# Altium schematic sheet ESP8266 Core.SchDoc
size 165 x 190 mm
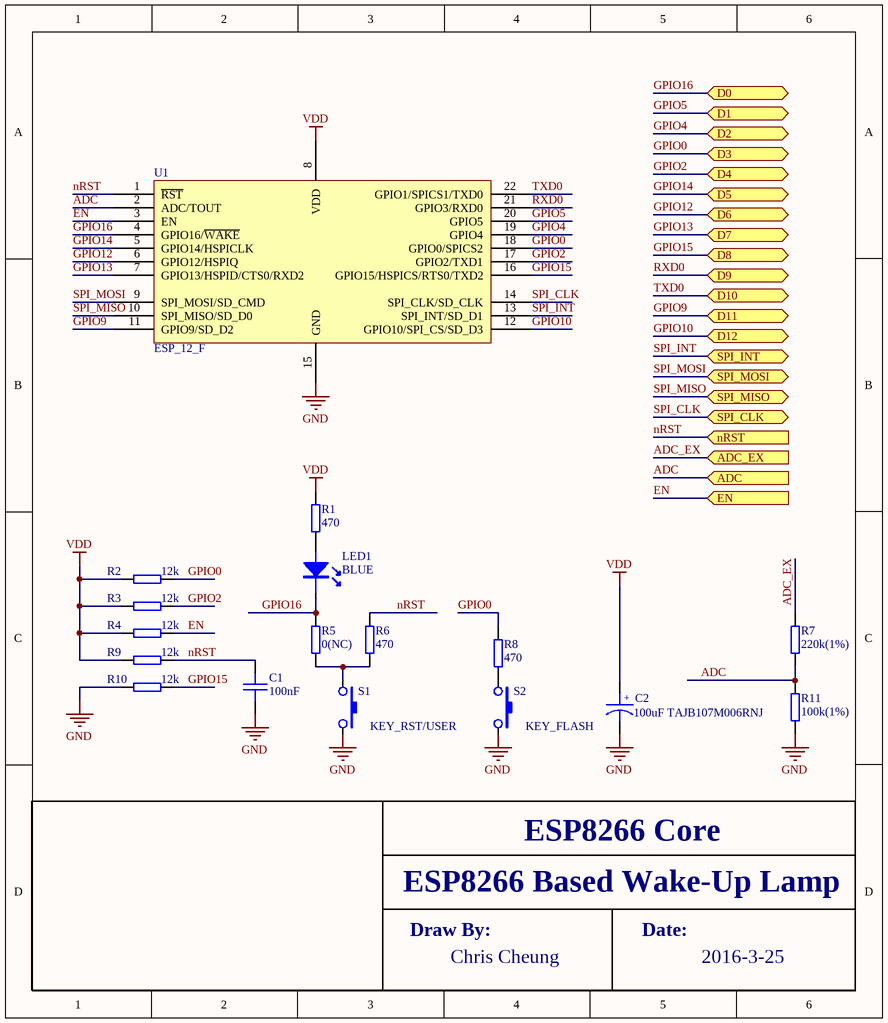
[diagram p0: ESP8266 Core.SchDoc]

## Parts
C1  100nF  [SMT_C_0402]
C2  100uF TAJB107M006RNJ  [SMT_C_Tantalum_B]
LED1  BLUE  [SMT_LED_0603]
R1  470  [SMT_R_0402]
R2  12k  [SMT_R_0402]
R3  12k  [SMT_R_0402]
R4  12k  [SMT_R_0402]
R5  0(NC)  [SMT_R_0402]
R6  470  [SMT_R_0402]
R7  220k(1%)  [SMT_R_0402]
R8  470  [SMT_R_0402]
R9  12k  [SMT_R_0402]
R10  12k  [SMT_R_0402]
R11  100k(1%)  [SMT_R_0402]
S1  KEY_RST/USER  [SMT_SW_PTS_820]
S2  KEY_FLASH  [SMT_SW_PTS_820]
U1  ESP_12_F  [ESP_12_E_L]

## Ports
ADC (in), ADC_EX (in), D0 (bidir), D1 (bidir), D2 (bidir), D3 (bidir), D4 (bidir), D5 (bidir), D6 (bidir), D7 (bidir), D8 (bidir), D9 (bidir), D10 (bidir), D11 (bidir), D12 (bidir), EN (in), nRST (in), SPI_CLK (bidir), SPI_INT (bidir), SPI_MISO (bidir), SPI_MOSI (bidir)

## Nets
GND: C1.2 C2.2 R10.1 R11.1 S1.2 S2.2 U1.15(GND)
VDD: C2.1 R1.2 R2.1 R3.1 R4.1 R9.1 U1.8(VDD)
ADC: R7.1 R11.2 U1.2(ADC/TOUT) ; port ADC
ADC_EX: R7.2 ; port ADC_EX
EN: R4.2 U1.3(EN) ; port EN
GPIO0: R2.2 R8.2 U1.18(GPIO0/SPICS2) ; port D3
GPIO2: R3.2 U1.17(GPIO2/TXD1) ; port D4
GPIO4: U1.19(GPIO4) ; port D2
GPIO5: U1.20(GPIO5) ; port D1
GPIO9: U1.11(GPIO9/SD_D2) ; port D11
GPIO10: U1.12(GPIO10/SPI_CS/SD_D3) ; port D12
GPIO12: U1.6(GPIO12/HSPIQ) ; port D6
GPIO13: U1.7(GPIO13/HSPID/CTS0/RXD2) ; port D7
GPIO14: U1.5(GPIO14/HSPICLK) ; port D5
GPIO15: R10.2 U1.16(GPIO15/HSPICS/RTS0/TXD2) ; port D8
GPIO16: LED1.2(K) R5.2 U1.4(GPIO16/~{WAKE}) ; port D0
nRST: C1.1 R6.2 R9.2 U1.1(~{RST}) ; port nRST
RXD0: U1.21(GPIO3/RXD0) ; port D9
SPI_CLK: U1.14(SPI_CLK/SD_CLK) ; port SPI_CLK
SPI_INT: U1.13(SPI_INT/SD_D1) ; port SPI_INT
SPI_MISO: U1.10(SPI_MISO/SD_D0) ; port SPI_MISO
SPI_MOSI: U1.9(SPI_MOSI/SD_CMD) ; port SPI_MOSI
TXD0: U1.22(GPIO1/SPICS1/TXD0) ; port D10
NetLED1_1: LED1.1(A) R1.1
NetR5_1: R5.1 R6.1 S1.1
NetR8_1: R8.1 S2.1

## Notes on the sheet
- ESP8266 Based Wake-Up Lamp
- ESP8266 Core
- Draw By:
- Chris Cheung
- Date:
- 2016-3-25
- (in symbol SMT_C_Tantalum_B) +

## Library data of the parts
C1 = SMT_C_0402: Surface mount capacitor 0402
C2 = SMT_C_Tantalum_B: Capacitor, SM Tantalum; Body 3.5 x 2.8 mm (LxW typ)
LED1 = SMT_LED_0603: SMT LED
R1-R11 = SMT_R_0402: Surface mount resistor 0402
S1 S2 = SMT_SW_PTS_820: SMT Tactile ‎Switch PTS 820 Series
U1 = ESP_12_E: ESP-12 Wi-Fi Module by AI-Thinker; IC: ESP8266-EX; Vendor: Ai-thinker